# EAGLE design bs_prod (EAGLE 6.5.0)
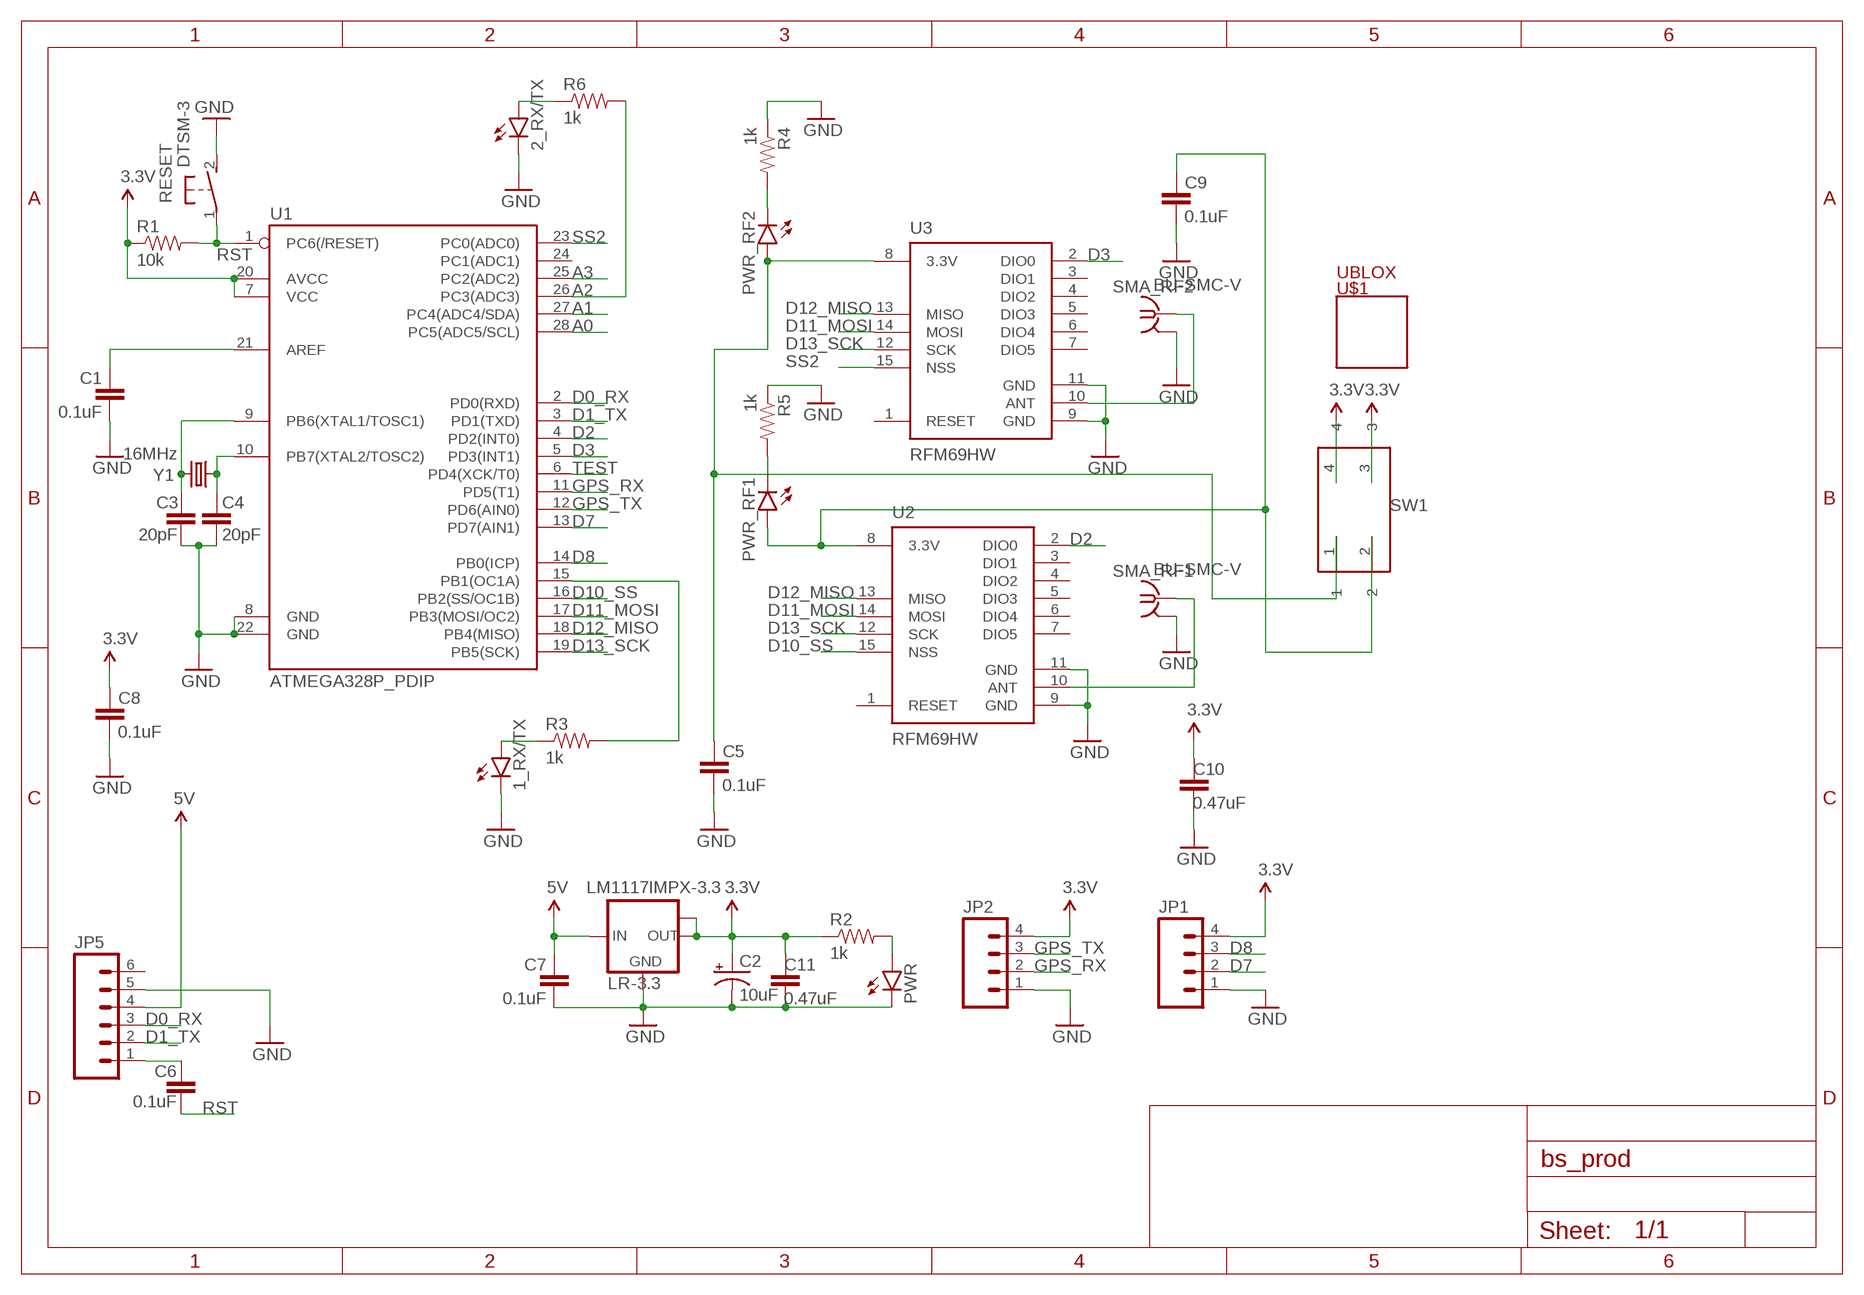
[diagram p0: schematic, sheet 1]

## Parts
1_RX/TX  LED1206  [LED-1206]
2_RX/TX  LED1206  [LED-1206]
C1  0.1uF  CAP1206  [1206]
C2  10uF  CAP_POLC  [PANASONIC_C]
C3  20pF  CAP1206  [1206]
C4  20pF  CAP1206  [1206]
C5  0.1uF  CAP1206  [1206]
C6  0.1uF  CAP1206  [1206]
C7  0.1uF  CAP1206  [1206]
C8  0.1uF  CAP1206  [1206]
C9  0.1uF  CAP1206  [1206]
C10  0.47uF  CAP1206  [1206]
C11  0.47uF  CAP1206  [1206]
JP1  M04PTH  [1X04]
JP2  M04PTH  [1X04]
JP5  M06SIP  [1X06]
LR-3.3  LM1117IMPX-3.3  [SOT223]
PWR  LED1206  [LED-1206]
PWR_RF1  LED1206  [LED-1206]
PWR_RF2  LED1206  [LED-1206]
R1  10k  RESISTOR1206  [1206]
R2  1k  RESISTOR1206  [1206]
R3  1k  RESISTOR1206  [1206]
R4  1k  RESISTOR1206  [1206]
R5  1k  RESISTOR1206  [1206]
R6  1k  RESISTOR1206  [1206]
RESET  DTSM-3  [DTSM-3]
SMA_RF1  BU-SMC-V  [BU-SMC-V]
SMA_RF2  BU-SMC-V  [BU-SMC-V]
SW1  418117270902  [418117270902]
U1  ATMEGA328P_PDIP  [DIL28-3]
U2  RFM69HW  [RFM69W-XXXS2]
U3  RFM69HW  [RFM69W-XXXS2]
U$1  UBLOX  [UBLOX]
Y1  16MHz  CRYSTALSMD  [HC49UP]

## Nets
3.3V: C2.+ C8.1 C10.1 C11.1 JP1.4 JP2.4 LR-3.3.2(OUT) LR-3.3.TAB(OUT1) R1.1 R2.1 SW1.3 SW1.4 U1.7(VCC) U1.20(AVCC)
5V: C7.1 JP5.4 LR-3.3.3(IN)
A0: U1.28(PC5(ADC5/SCL))
A1: U1.27(PC4(ADC4/SDA))
A2: R6.2 U1.26(PC3(ADC3))
A3: U1.25(PC2(ADC2))
D0_RX: JP5.3 U1.2(PD0(RXD))
D1_TX: JP5.2 U1.3(PD1(TXD))
D2: U1.4(PD2(INT0)) U2.2(DIO0)
D3: U1.5(PD3(INT1)) U3.2(DIO0)
D7: JP1.2 U1.13(PD7(AIN1))
D8: JP1.3 U1.14(PB0(ICP))
D10_SS: U1.16(PB2(SS/OC1B)) U2.15(NSS)
D11_MOSI: U1.17(PB3(MOSI/OC2)) U2.14(MOSI) U3.14(MOSI)
D12_MISO: U1.18(PB4(MISO)) U2.13(MISO) U3.13(MISO)
D13_SCK: U1.19(PB5(SCK)) U2.12(SCK) U3.12(SCK)
GND: 1_RX/TX.C 2_RX/TX.C C1.2 C2.- C3.2 C4.2 C5.2 C7.2 C8.2 C9.2 C10.2 C11.2 JP1.1 JP2.1 JP5.5 LR-3.3.1(GND) PWR.C R4.1 R5.1 RESET.2 SMA_RF1.2 SMA_RF1.3 SMA_RF1.4 SMA_RF1.5 SMA_RF2.2 SMA_RF2.3 SMA_RF2.4 SMA_RF2.5 U1.8(GND) U1.22(GND) U2.9(GND) U2.11(GND) U3.9(GND) U3.11(GND)
GPS_RX: JP2.2 U1.11(PD5(T1))
GPS_TX: JP2.3 U1.12(PD6(AIN0))
N$5: PWR.A R2.2
N$6: C3.1 U1.9(PB6(XTAL1/TOSC1)) Y1.2
N$7: C4.1 U1.10(PB7(XTAL2/TOSC2)) Y1.1
N$8: SMA_RF1.1 U2.10(ANT)
N$9: PWR_RF2.C R4.2
N$11: C6.1 JP5.1
N$12: 1_RX/TX.A R3.1
N$13: 2_RX/TX.A R6.1
N$16: C1.1 U1.21(AREF)
N$18: R3.2 U1.15(PB1(OC1A))
N$19: C5.1 PWR_RF2.A SW1.1 U3.8(3.3V)
N$20: PWR_RF1.C R5.2
N$21: C9.1 PWR_RF1.A SW1.2 U2.8(3.3V)
N$24: SMA_RF2.1 U3.10(ANT)
RST: C6.2 R1.2 RESET.1 U1.1(PC6(/RESET))
SS2: U1.23(PC0(ADC0)) U3.15(NSS)
TEST: U1.6(PD4(XCK/T0))
Unconnected: JP5.6 U1.24(PC1(ADC1)) U2.1(RESET) U2.3(DIO1) U2.4(DIO2) U2.5(DIO3) U2.6(DIO4) U2.7(DIO5) U3.1(RESET) U3.3(DIO1) U3.4(DIO2) U3.5(DIO3) U3.6(DIO4) U3.7(DIO5)

## Library data of the parts
1_RX/TX 2_RX/TX PWR PWR_RF1 PWR_RF2 = SparkFun-LED:LED: LEDs Standard schematic elements and footprints for 5mm, 3mm, 1206, and 0603 sized LEDs. 5mm - Spark Fun Electronics SKU : COM-00529 (and others)
C1 C3-C11 = SparkFun-Capacitors:CAP: Capacitor Standard 0603 ceramic capacitor, and 0.1" leaded capacitor.
C2 = SparkFun-Capacitors:CAP_POL: Capacitor Polarized These are standard SMD and PTH capacitors. Normally 10uF, 47uF, and 100uF in electrolytic and tantalum varieties. Always verify the external diameter of the through hole cap, it varies with capacity, voltage, and manufacturer. The EIA devices should be standard.
JP1 JP2 = SparkFun-Connectors:M04: Header 4 Standard 4-pin 0.1" header. Use with straight break away headers (SKU : PRT-00116), right angle break away headers (PRT-00553), swiss pins (PRT-00743), machine pins (PRT-00117), and female headers (PRT-00115). Molex polarized connector foot print use with SKU : PRT-08231 with associated crimp pins and housings. 1MM SMD Version SKU: PRT-10208
JP5 = SparkFun-Connectors:M06: Header 6 Standard 6-pin 0.1" header. Use with straight break away headers (SKU : PRT-00116), right angle break away headers (PRT-00553), swiss pins (PRT-00743), machine pins (PRT-00117), and female headers (PRT-00115). Molex polarized connector foot print use with SKU : PRT-08094 with associated crimp pins and housings. NOTES ON THE VARIANTS LOCK and LOCK_LONGPADS... This footprint was designed to help hold the alignment of a through-hole component (i.e. 6-pin header) while soldering it into place. You may notice that each hole has been shifted either up or down by 0.005 of an inch from it's more standard position (which is a perfectly straight line). This slight alteration caused the pins (the squares in the middle) to touch the edges of the holes. Because they are alternating, it causes a "brace" to hold the component in place. 0.005 has proven to be the perfect amount of "off-center" position when using our standard breakaway headers. Although looks a little odd when you look at the bare footprint, once you have a header in there, the alteration is very hard to notice. Also,if you push a header all the way into place, it is covered up entirely on the bottom side. This idea of altering the position of holes to aid alignment will be further integrated into the Sparkfun Library for other footprints. It can help hold any component with 3 or more connection pins.
LR-3.3 = lm1117:LM1117IMPX-*
R1-R6 = SparkFun-Resistors:RESISTOR: Resistor Basic schematic elements and footprints for 0603, 1206, and PTH resistors.
RESET = switch-tact:DTSM-3
SMA_RF1 SMA_RF2 = con-coax:BU-SMC-V: FEMALE SMC CONNECTOR Radiall R112 426 distributor RS 295-5429; OC_FARNELL: unknown; OC_NEWARK: unknown
SW1 = Eagle_Wuerth_Elektronik_Switch:418117270902: WS-BS 2.54 mm compact THT Dip Switch with raised actuator, 2 Pole
U1 = SparkFun-DigitalIC:ATMEGA328P_PDIP: uC used in the Arduino 32kb flash, 1k EEPROM, 2k SRAM This is the through-hole version of this chip.
U2 U3 = SparkFun-RF:RFM69H
U$1 = myGps:UBLOX
Y1 = SparkFun-FreqCtrl:CRYSTAL: Various standard crystals. Proven footprints. Spark Fun Electronics SKU : COM-00534

## Board
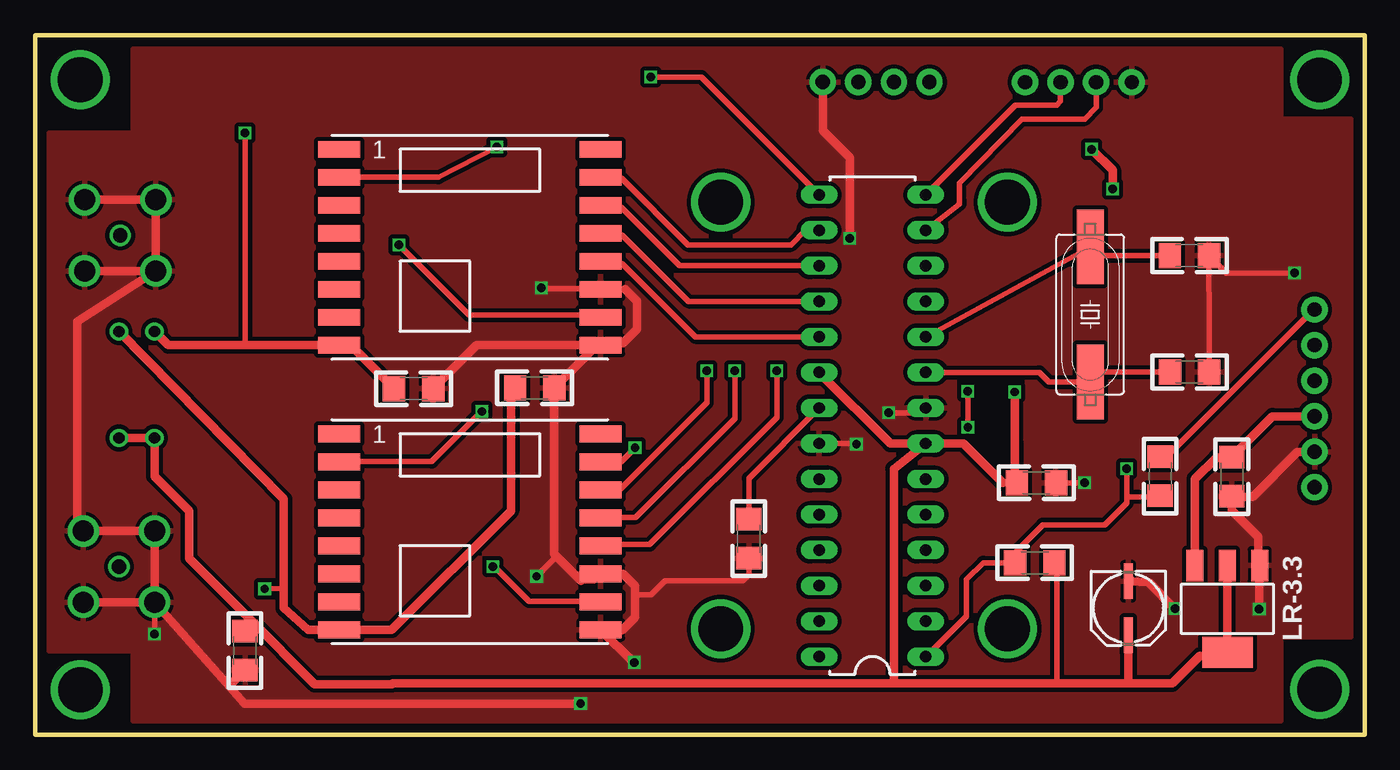
[diagram p1: board, top side]
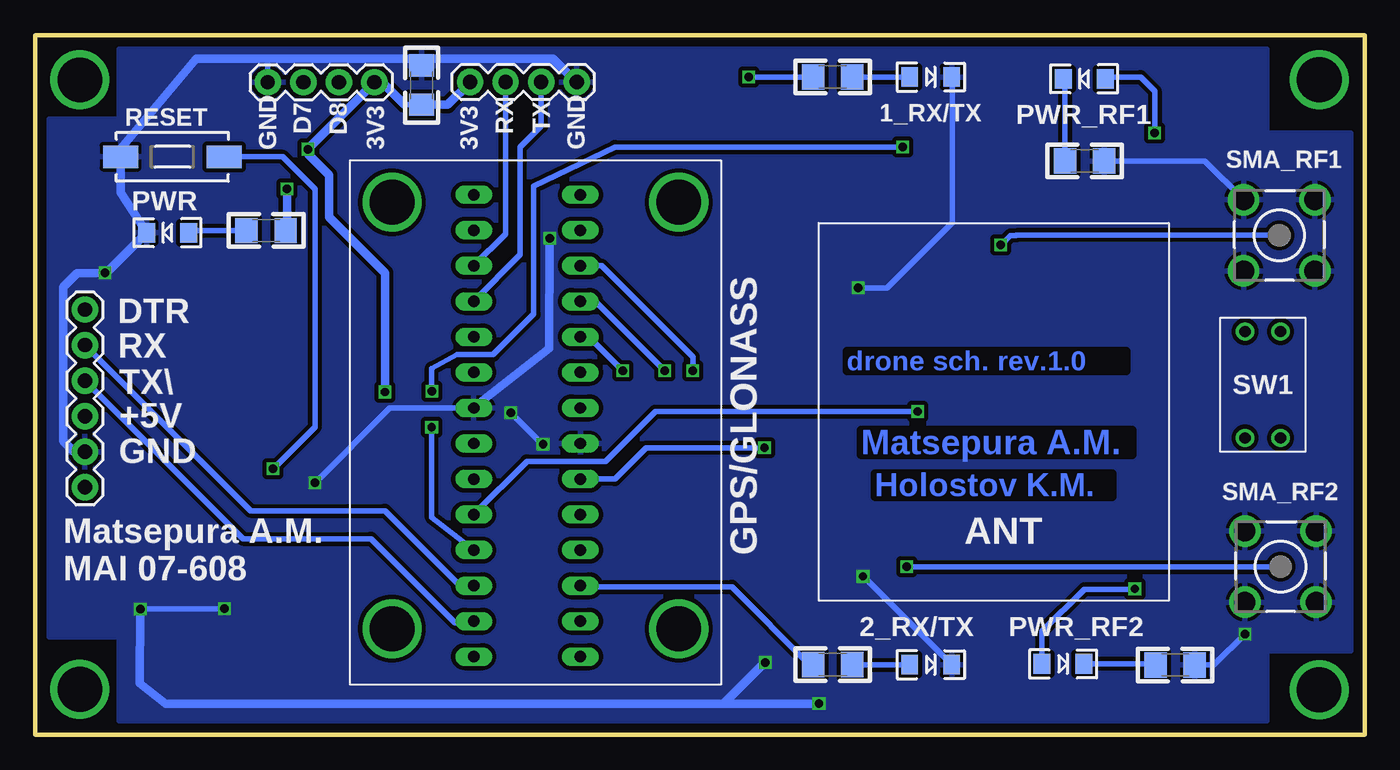
[diagram p2: board, bottom side, seen from below]

Size 95 x 50 mm. Coordinates in mm from the lower left corner, seen from the top.
Outline: 0,50 0,0 95,0 95,50 0,50
Copper layers (1*16): Top 0.035mm / dielectric 1.5mm / Bottom 0.035mm
Design rules "ITEADstudio_DRC *": minimum track width 6mil, minimum drill 12mil, track to track 12mil, track to pad 12mil, pad to pad 12mil, via to via 12mil, smd to smd 0mil, copper to edge 10mil, drill to drill 10mil, minimum pad ring 10mil, minimum via ring 6mil, stop-mask expansion 2mil, vias tented up to drill 100mil, thermal gap 10mil

### Footprints (pad centres in the part's own frame; a part is rotated, then mirrored left to right if it is on the bottom)
LED-1206 = smd 1.2 x 1.4: A -1.5,0; C 1.5,0
1206 = smd 1.6 x 1.8: 1 -1.4,0; 2 1.4,0
PANASONIC_C = smd 2.54 x 0.65: + 1.976,-0.2; - -1.876,-0.2
1X04 = drill 1.016 pad 1.88: 1 0,0; 2 2.54,0; 3 5.08,0; 4 7.62,0
1X06 = drill 1.016 pad 1.88: 1 0,0; 2 2.54,0; 3 5.08,0; 4 7.62,0; 5 10.16,0; 6 12.7,0
SOT223 = smd 1.219 x 2.235: 1 -2.311,-3.099; 2 0,-3.099; 3 2.311,-3.099 | smd 3.6 x 2.2: TAB 0,3.099
DTSM-3 = smd 2.5 x 1.6: 1 -3.7,0; 2 3.7,0
BU-SMC-V = drill 1.016: 1 0,0 | drill 1.5: 2 -2.54,2.54; 3 2.54,2.54; 4 2.54,-2.54; 5 -2.54,-2.54
418117270902 = drill 0.8: 1 0,-3.81; 2 2.54,-3.81; 3 2.54,3.81; 4 0,3.81
DIL28-3 = drill 0.813 long: 1 -16.51,-3.81; 2 -13.97,-3.81; 3 -11.43,-3.81; 4 -8.89,-3.81; 5 -6.35,-3.81; 6 -3.81,-3.81; 7 -1.27,-3.81; 8 1.27,-3.81; 9 3.81,-3.81; 10 6.35,-3.81; 11 8.89,-3.81; 12 11.43,-3.81; 13 13.97,-3.81; 14 16.51,-3.81; 15 16.51,3.81; 16 13.97,3.81; 17 11.43,3.81; 18 8.89,3.81; 19 6.35,3.81; 20 3.81,3.81; 21 1.27,3.81; 22 -1.27,3.81; 23 -3.81,3.81; 24 -6.35,3.81; 25 -8.89,3.81; 26 -11.43,3.81; 27 -13.97,3.81; 28 -16.51,3.81
RFM69W-XXXS2 = smd 3 x 1.2: 1 -9.35,7; 2 -9.35,5; 3 -9.35,3; 4 -9.35,1; 5 -9.35,-1; 6 -9.35,-3; 7 -9.35,-5; 8 -9.35,-7; 9 9.35,-7; 10 9.35,-5; 11 9.35,-3; 12 9.35,-1; 13 9.35,1; 14 9.35,3; 15 9.35,5; 16 9.35,7
UBLOX = drill 3.2: P$1 -15,9.492; P$2 15.492,9.492; P$3 15.492,-11; P$4 -15,-11
HC49UP = smd 5.334 x 1.93: 1 -4.826,0; 2 4.826,0

### Placement (x,y rotation side)
1_RX/TX  31,47 0 bottom
2_RX/TX  31,5 0 bottom
C1  51,14 270 top
C2  78.32,9.08 270 top
C3  22pF  [1206]  82.5,25.91 0 top
C4  22pF  [1206]  82.49,34.24 0 top
C5  35.7,24.78 0 top
C6  80.4,18.46 270 top
C7  85.52,18.43 270 top
C8  71.56,17.99 0 top
C9  27.05,24.72 0 top
C10  67.38,46.42 90 bottom
C11  15,6 270 top
JP1  78.37,46.62 0 bottom
JP2  56.29,46.63 180 bottom
JP5  91.43,30.37 270 bottom
LR-3.3  85.2,8.98 180 top
PWR  85.53,35.87 180 bottom
PWR_RF1  20.03,46.86 180 bottom
PWR_RF2  21.55,5.05 0 bottom
R1  71.44,12.28 180 top
R2  78.49,36.03 180 bottom
R3  38,47 180 bottom
R4  13.53,4.97 180 bottom
R5  20,41 180 bottom
R6  38,5 180 bottom
RESET  85.18,41.3 180 bottom
SMA_RF1  6.09,35.67 0 bottom
SMA_RF2  6,12 0 bottom
SW1  6,25 180 bottom
U1  59.84,22.07 90 top
U2  31.07,34.82 0 top
U3  31.08,14.48 0 top
U$1  60,22.56 90 bottom
Y1  75.4,30.03 270 top

### Tracks (layer width: path | path; a pad name or v marks a point on that pad's centre or on a via)
3.3V  (via drill 0.6)
  Top 0.406: 83.24,5.64 83.39,5.64 83.63,5.88 LR-3.3.TAB | C2.+ 78.13,7.17 | R1.1 73,12.12 73,3.66 | 25.55,3.66 25.5,3.61 | C11.1 15.3,7.7 15.3,8.3 | 70,21 | 70,18 70.01,17.99 C8.1 69.16,17.99
  Top 0.61: 25.55,3.66 61.37,3.66 | 61.37,3.66 73,3.66 78.13,3.66 | 78.13,3.66 81.25,3.66 83.24,5.64 | 78.13,7.17 78.13,3.66 | LR-3.3.TAB LR-3.3.2 | U1.7 61.37,19 61.37,3.66 | U1.20 61.11,20.8 U1.7 | 25.5,3.61 19.99,3.61 15.3,8.3 11,12.6 11,16 8.54,18.46 SW1.3 SW1.4 | v75.49,41.83 77,40.32 v77,39 | U1.7 66.35,20.8 69.16,17.99 | 70,21 v70,24.49 | 70,21 70,18
  Bottom 0.406: R2.1 77,36.11 | 63.92,46.62 JP2.4 63.91,46.6 | 75.49,41.88 v75.49,41.83 75.49,41.49 | C10.1 67.4,45.03 68.61,45.03 | 70.19,46.62 JP1.4 | v70,24.49
  Bottom 0.61: 77,36.11 v77,39 | JP1.4 75.49,41.88 | C10.1 65.51,45.01 63.91,46.6 | 68.61,45.03 70.19,46.62 | v70,24.49 70,33 74,37 74,40 75.49,41.49
5V
  Top 0.406: JP5.4 91.41,22.73 | C7.1 85.5,19.81
  Top 0.61: 91.41,22.73 90.09,22.73 88.42,22.73 C7.1 | LR-3.3.3 82.89,13.89 82.89,18.27 84.43,19.81 85.5,19.81
A2
  Bottom 0.406: U1.26 55.96,10.57 45.21,10.57 39.65,5 R6.2
D0_RX
  Bottom 0.406: JP5.3 80.14,14 71,14 65,8 63,8 63.1,8.1 U1.2
D1_TX
  Bottom 0.406: JP5.2 79.6,16 70,16 64.64,10.64 U1.3
D2  (via drill 0.6)
  Top 0.406: v66.66,21.98 66.65,22.29 v66.65,24.54 | v33,42 28.82,39.82 U2.2
  Bottom 0.406: U1.4 66.66,15.53 v66.66,21.98 | v66.65,24.54 66.66,24.96 66.66,26.18 64.85,27.15 62.26,27.15 59.36,30.05 59.36,39.2 53.56,42 v33,42
D3  (via drill 0.6)
  Top 0.406: v31.93,23.09 28.35,19.51 22.28,19.51 22.25,19.48 U3.2
  Bottom 0.406: U1.5 59.84,19.53 54.23,19.53 50.67,23.09 v31.93,23.09
D7
  Top 0.406: JP1.2 75.83,44.83 75,44 70.52,44 66.06,39.4 66.06,38.15 66.07,37.92 U1.13
D8
  Top 0.406: U1.14 70.07,45 73,45 73.29,45.29 JP1.3
D10_SS
  Top 0.406: U2.15 40.5,39.75 41.91,39.75 46.66,35 54,35 55.04,36.04 U1.16
D11_MOSI  (via drill 0.6)
  Top 0.406: U2.14 40.55,37.69 41.86,37.69 46.05,33.5 U1.17 | U3.14 41.76,17.48 48,23.72 v48,26
  Bottom 0.406: v48,26 48,27 54.5,33.5 U1.17
D12_MISO  (via drill 0.6)
  Top 0.406: U2.13 40.54,35.71 41.96,35.71 46.71,30.96 U1.18 | U3.13 40.44,15.47 41.78,15.47 41.83,15.52 42.93,15.52 50,22.59 v50,26
  Bottom 0.406: v50,26 54.96,30.96 U1.18
D13_SCK  (via drill 0.6)
  Top 0.406: U2.12 40.59,33.66 41.96,33.66 47.2,28.42 U1.19 | U3.12 40.53,13.59 43.92,13.59 53,22.67 v53,26
  Bottom 0.406: v53,26 55.42,28.42 U1.19
GND  (via drill 0.6)
  Top 0.406: 42.75,5.16 v42.82,5.16 | U1.8 63.31,23 v61,23 | v58.7,20.75 58.65,20.8 U1.22 | U3.9 40.47,7.44 41.94,7.44 | 42.01,11.48 U3.11 39.94,11 39,11 | 87.48,11.15 87.51,11.49 LR-3.3.1 87.43,12.16 | C8.2 v75,18 | C1.2 51,11.46 50.55,11 45,11 44,10 42.88,10 | 42,28 40.6,28 U2.9 40.15,27.82 | 42.18,31.82 U2.11 39.68,31.82 39.62,31.88 36.22,31.88 v36.17,31.93 | SMA_RF2.2 8.63,14.63 | v35.84,11.3 37.1,12.56 37.1,12.9 | 3,14 3.46,14.46 SMA_RF2.3 | v8.53,7.19 v8.54,7.19 SMA_RF2.5 | C2.- 78.37,11.12 | 14.1,3.7 13.66,3.7 | 89.97,33.03 v90,33 85.13,33 C4.2 83.9,29.03 C3.2 | C7.2 85.56,17
  Top 0.61: U3.9 42.75,5.16 | 41.94,7.44 42.88,8.38 42.88,10 42.88,10.62 42.01,11.48 | 87.48,11.15 v87.48,8.97 | v81.46,8.99 79.57,10.88 C2.- | 39,11 37.1,12.9 C5.2 40.15,27.82 | C9.2 31.56,27.82 U2.9 | 42,28 43,29 43,31 42.18,31.82 | SMA_RF2.5 13.66,3.7 14.98,2.2 v38.98,2.2 | SMA_RF2.5 SMA_RF2.4 | SMA_RF2.5 SMA_RF2.2 SMA_RF2.3 | SMA_RF1.5 SMA_RF1.4 | SMA_RF1.5 SMA_RF1.2 SMA_RF1.3 | v58.22,35.46 58.22,41.22 56.29,43.15 JP2.1 | SMA_RF1.5 3,29.51 3,14 | C11.2 14.1,3.7 | 85.56,17 87,17 90.21,20.21 JP5.5 | 87.43,12.16 87.43,14.12 85.52,16.03 C7.2
  Bottom 0.406: 92.21,20.21 JP5.5 | v61,23 58.75,20.75 v58.7,20.75 | v87.48,8.97 87.14,9 82,9 81.99,8.99 v81.46,8.99 | 69.66,23.34 U1.8 | v75,18 69.66,23.34 | 69.66,23.34 63.7,23.34 | 2_RX/TX.C 35.8,11.3 v35.84,11.3 | v36.17,31.93 34.14,31.93 29.46,36.6 29.46,46.96 1_RX/TX.C | JP1.1 78.38,46.64 78.38,48.31 | 88.88,41.89 RESET.2 | 89.89,33 v90,33 | C10.2 67,48.2 67,48.31 | v8.53,7.19 10.76,4.97 R4.1 | SMA_RF1.2 11.41,41 R5.1
  Bottom 0.61: v42.82,5.16 45.8,2.18 | 45.8,2.18 85.67,2.18 87.5,3.66 v87.48,8.97 | 92.21,20.21 93,21 93,32 92,33 v90,33 | JP2.1 57.97,48.31 67,48.31 78.38,48.31 83.46,48.31 88.88,41.89 | v38.98,2.2 40.18,2.18 45.8,2.18 | 63.7,23.34 58.27,27.58 v58.22,35.46 | RESET.2 88.88,38.72 PWR.C 89.89,33
  pour Bottom: 7,49 7,43 1,43 1,6 7,6 7,1 89,1 89,7 94,7 94,44 89,44 89,49
  pour Top: 7,48 7,43 1,43 1,6 7,6 7,1 89,1 89,7 94,7 94,44 89,44 89,49 7,49
GPS_RX
  Bottom 0.406: U1.11 60.33,34.29 60.33,41.99 58.83,43.48 JP2.2
GPS_TX
  Bottom 0.406: U1.12 61.37,35.78 JP2.3
N$1  (via drill 3.2)
  other vias: 3.23,46.8
N$2  (via drill 3.2 pad 2.54)
  other vias: 91.79,3.23
N$5
  Bottom 0.406: PWR.A 83.87,36.03 R2.2
N$6
  Top 0.406: U1.9 71.75,25.88 72.44,25.2 Y1.2 76.11,25.91 C3.1
N$7
  Top 0.406: U1.10 Y1.1 76.01,34.24 C4.1
N$8  (via drill 0.6)
  Top 0.406: 40,30 40.25,30 U2.10 40.82,29.82 41,30 31,30 v26,35
  Bottom 0.406: SMA_RF1.1 6.1,35.69 24.89,35.69 24.92,35.66 25.3,35.66 25.96,35 v26,35
N$9
  Bottom 0.406: R4.2 15.02,5.05 PWR_RF2.C
N$10  (via drill 3.2 pad 2.54)
  other vias: 91.79,46.79
N$11
  Top 0.406: JP5.1 91.37,30.37 80.86,19.86 C6.1 80.5,19.96
N$12
  Bottom 0.406: R3.1 1_RX/TX.A
N$13
  Bottom 0.406: R6.1 2_RX/TX.A
N$16
  Top 0.406: U1.21 51,18.31 C1.1 51,15
N$17  (via drill 3.2)
  other vias: 3.25,3.2
N$18  (via drill 0.6)
  Top 0.406: U1.15 47.61,47 v44,47
  Bottom 0.406: v44,47 R3.2
N$19  (via drill 0.6)
  Top 0.406: v16.41,10.41 17.77,10.44 | C5.1 34,24.48
  Top 0.61: SW1.1 17.77,16.84 17.77,10.44 17.77,9.05 19.52,7.48 U3.8 25.48,7.48 34,16 34,24.48
  Bottom 0.406: v16.41,10.41 v16.41,10.4 16.42,10.39 20.02,10.39 23.05,7.36 PWR_RF2.A
N$20
  Bottom 0.406: PWR_RF1.C 21.4,46.74 R5.2
N$21  (via drill 0.6)
  Top 0.406: 22.54,27.82 U2.8 | v15,43 15,27.82
  Top 0.61: SW1.2 9.53,27.82 15,27.82 U2.8 | C9.1 22.54,27.82
  Bottom 0.406: PWR_RF1.A 18.39,47 16,47 15,46 v15,43
N$24  (via drill 0.6)
  Top 0.406: U3.10 40.38,9.53 35.31,9.53 32.84,11.99 v32.72,11.99
  Bottom 0.406: v32.72,11.99 32.7,12 SMA_RF2.1
RST  (via drill 0.6)
  Top 0.406: 70.04,11.95 R1.2 | R1.2 70.04,12.04 70,12 70,13 72,15 76.46,15 78,16.54 78,17 | 78,17 v78,19 | U1.1 66.55,8.46 66.55,11.07 67.75,12.28 R1.2 | C6.2 80.33,17 78,17
  Bottom 0.406: v78,19 75,22 75,39 77.3,41.3 RESET.1
SS2  (via drill 0.6)
  Top 0.406: U3.15 41.86,19.48 v42.88,20.5
  Bottom 0.406: v42.88,20.5 51.33,20.5 53.57,18.26 U1.23

### Text on the board
Bottom: drone sch. rev.1.0 | Matsepura A.M. | Holostov K.M.
bNames: TX | RX | D8 | D7 | GND | 3V3 | 3V3 | GND | DTR | RX | TX\ | +5V | GND | Matsepura A.M. / MAI 07-608